# EAGLE board os22s (EAGLE 7.1.0)
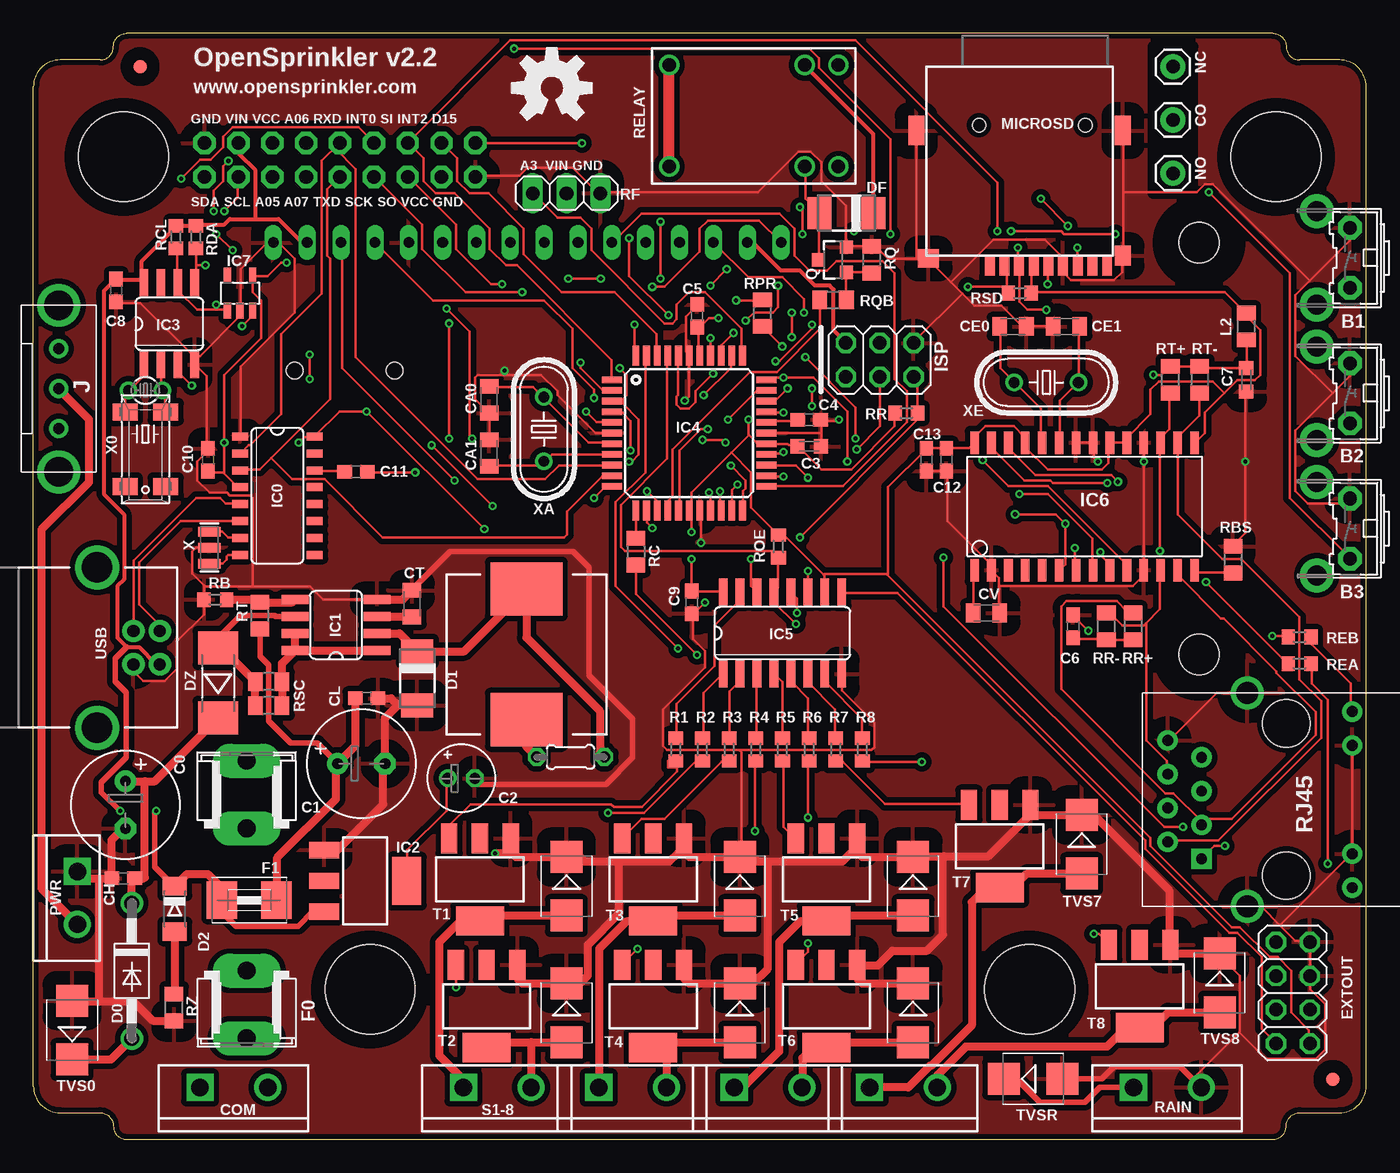
[diagram p1: board, top side]
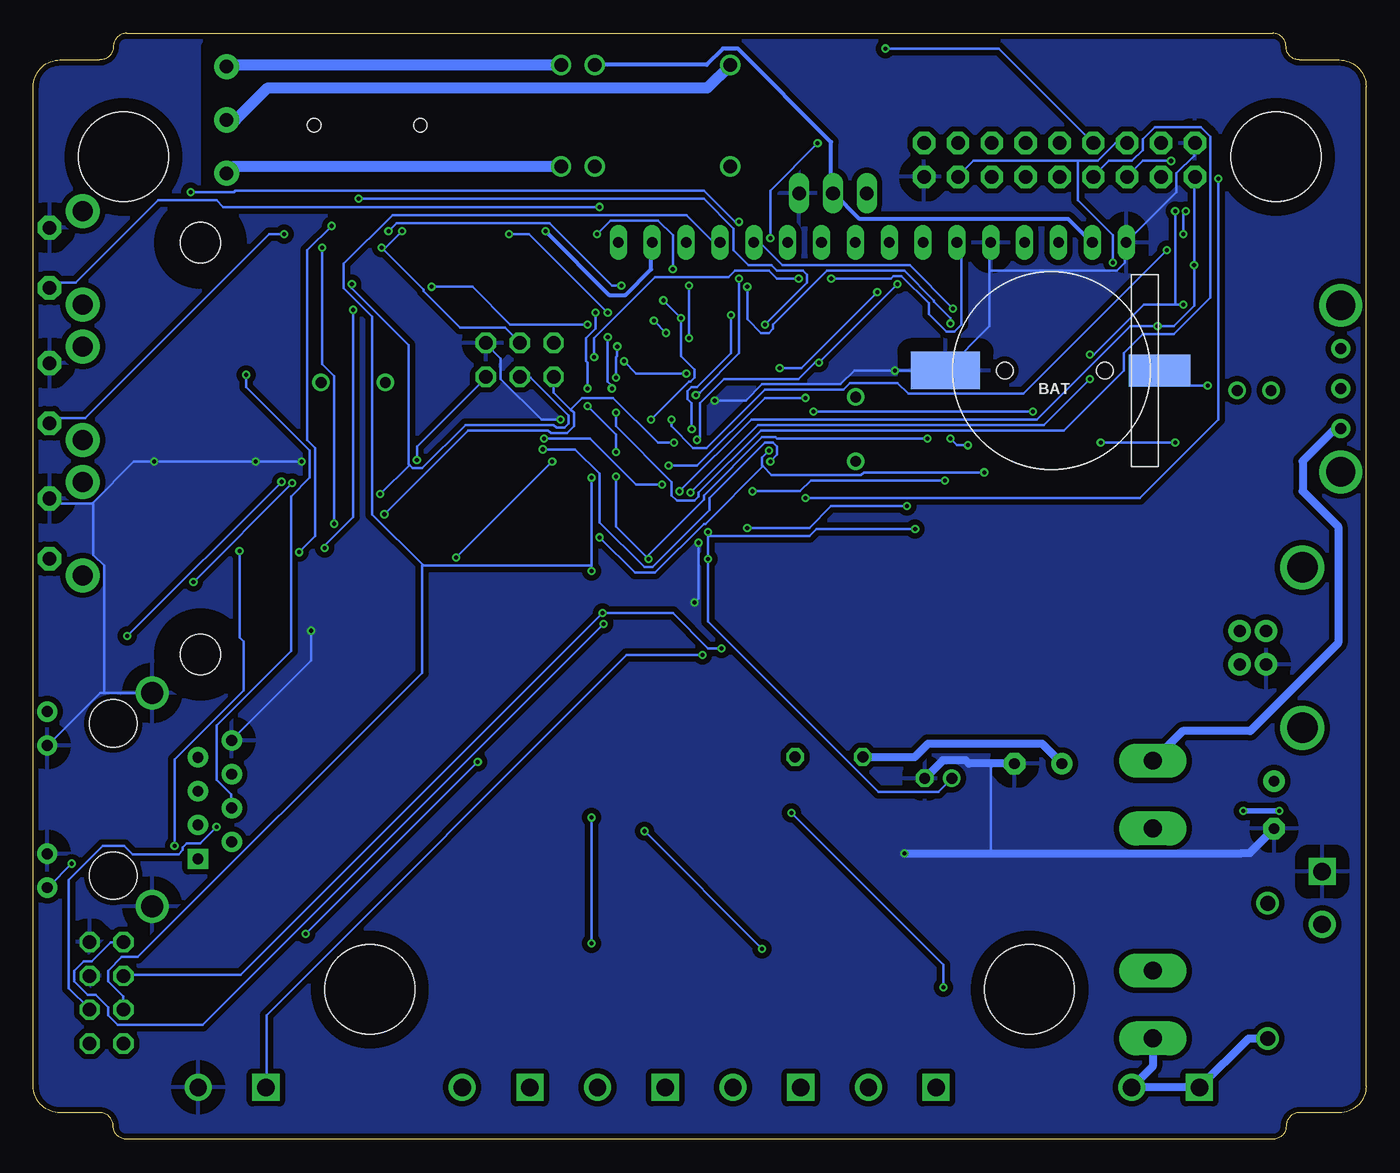
[diagram p2: board, bottom side, seen from below]

Size 100 x 83 mm. Coordinates in mm from the lower left corner, seen from the top.
Outline: 98,81 95,81 arc-90 94,82 arc90 93,83 7,83 arc90 6,82 arc-90 5,81 2,81 arc90 0,79 0,4 arc90 2,2 5,2 arc-90 6,1 arc90 7,0 93,0 arc90 94,1 arc-90 95,2 98,2 arc90 100,4 100,79 arc90 98,81
Copper layers (1*16): Top 0.035mm / dielectric 1.5mm / Bottom 0.035mm
Design rules "Fusion_eagle_rule_v1.1 *": minimum track width 6mil, minimum drill 12mil, track to track 6mil, track to pad 6mil, pad to pad 6mil, via to via 6mil, smd to smd 0mil, copper to edge 10mil, drill to drill 10mil, minimum pad ring 10mil, minimum via ring 6mil, stop-mask expansion 2mil, vias tented up to drill 100mil, thermal gap 40mil
Net classes: 0 default: width 0.203 mm, clearance 0.203 mm; 1 power: width 0.305 mm, clearance 0.203 mm; 2 relaypower: width 0.813 mm, clearance 0.305 mm
Holes 3.05 mm at 87.46,67.3 87.46,36.38
Holes 6.75 mm at 6.76,73.74 93.24,73.74 25.26,11.26 74.74,11.26
tRestrict: area 84.4,33.3 to 90.5,39.4; area 84.4,64.2 to 90.5,70.3; area 2.8,69.7 to 10.8,77.7; area 89.2,69.7 to 97.2,77.7; area 21.3,7.3 to 29.3,15.3; area 70.7,7.3 to 78.7,15.3; area 84,71 to 87,82
bRestrict: area 2.8,69.7 to 10.8,77.7; area 89.2,69.7 to 97.2,77.7; area 21.3,7.3 to 29.3,15.3; area 70.7,7.3 to 78.7,15.3; area 84.4,64.2 to 90.5,70.3; area 84.4,33.3 to 90.5,39.4; area 84,71 to 87,82
vRestrict: area 11.8,70 to 34.2,70.8; area 11.8,76.2 to 34.3,76.9; area 36.5,72.7 to 43.2,73.4

## Footprints (pad centres in the part's own frame; a part is rotated, then mirrored left to right if it is on the bottom)
B3F-31XX = drill 1.016 pad 1.778 octagon: 1 -2.261,-1.245; 2 2.261,-1.245 | drill 1.499 pad 2.54: 3 -3.505,1.245; 4 3.505,1.245
BATTCON_12MM_SMT = smd 2.8 x 5.2: P$1 0,11.96 | smd 2.4 x 4.6: P$2 0,-4.1 | hole 1.25: 0,7.5; 0,0
E3,5-8 = drill 0.813 pad 1.6: + -1.778,0 | drill 0.813 pad 1.6 octagon: - 1.778,0
E2-5 = drill 0.813 pad 1.27: + -1.016,0 | drill 0.813 pad 1.27 octagon: - 1.016,0
C0603K = smd 1.05 x 1.08: 1 -0.875,0; 2 0.875,0
C0603 = smd 1.1 x 1: 1 -0.85,0; 2 0.85,0
C0805K = smd 1.1 x 1.4: 1 -1,0; 2 1,0
SCREWTERMINAL-5MM-2-X = drill 1.3 pad 2.032 square: 1 0,0 | drill 1.3 pad 2.032: 2 5.08,0
DO41-10 = drill 1.118: A 5.08,0; C -5.08,0
DO-214AC = smd 1.8 x 2.4: A 2.025,0; C -2.025,0
MINIMELF = smd 1.4 x 1.8: A 1.7,0; C -1.7,0
MELF-MLL41 = smd 2.5 x 3: A 2.625,0; C -2.625,0
2X04 = drill 1.016 octagon: 1 -3.81,-1.27; 2 -3.81,1.27; 3 -1.27,-1.27; 4 -1.27,1.27; 5 1.27,-1.27; 6 1.27,1.27; 7 3.81,-1.27; 8 3.81,1.27
SHK20L = drill 1.321 pad 2.54 long: 1A -10.414,0; 1B -5.334,0; 2A 10.414,0; 2B 5.334,0
1812 = smd 2.286 x 2.794: 1 -2.046,0; 2 2.046,0
SO16 = smd 0.6 x 1.2: 1 -4.445,-2.8; 2 -3.175,-2.8; 3 -1.905,-2.8; 4 -0.635,-2.8; 5 0.635,-2.8; 6 1.905,-2.8; 7 3.175,-2.8; 8 4.445,-2.8; 9 4.445,2.8; 10 3.175,2.8; 11 1.905,2.8; 12 0.635,2.8; 13 -0.635,2.8; 14 -1.905,2.8; 15 -3.175,2.8; 16 -4.445,2.8
SO08 = smd 0.66 x 2.032: 1 -1.905,-3.073; 2 -0.635,-3.073; 3 0.635,-3.073; 4 1.905,-3.073; 5 1.905,3.073; 6 0.635,3.073; 7 -0.635,3.073; 8 -1.905,3.073
SOT223 = smd 1.219 x 2.235: 1 -2.311,-3.099; 2 0,-3.099; 3 2.311,-3.099 | smd 3.6 x 2.2: 4 0,3.099
TQFP44 = smd 1.5 x 0.5: 1 -5.8,4; 2 -5.8,3.2; 3 -5.8,2.4; 4 -5.8,1.6; 5 -5.8,0.8; 6 -5.8,0; 7 -5.8,-0.8; 8 -5.8,-1.6; 9 -5.8,-2.4; 10 -5.8,-3.2; 11 -5.8,-4; 23 5.8,-4; 24 5.8,-3.2; 25 5.8,-2.4; 26 5.8,-1.6; 27 5.8,-0.8; 28 5.8,0; 29 5.8,0.8; 30 5.8,1.6; 31 5.8,2.4; 32 5.8,3.2; 33 5.8,4 | smd 0.5 x 1.5: 12 -4,-5.8; 13 -3.2,-5.8; 14 -2.4,-5.8; 15 -1.6,-5.8; 16 -0.8,-5.8; 17 0,-5.8; 18 0.8,-5.8; 19 1.6,-5.8; 20 2.4,-5.8; 21 3.2,-5.8; 22 4,-5.8; 34 4,5.8; 35 3.2,5.8; 36 2.4,5.8; 37 1.6,5.8; 38 0.8,5.8; 39 0,5.8; 40 -0.8,5.8; 41 -1.6,5.8; 42 -2.4,5.8; 43 -3.2,5.8; 44 -4,5.8
SO16' = smd 0.66 x 2.032: 1 -4.445,-3.073; 2 -3.175,-3.073; 3 -1.905,-3.073; 4 -0.635,-3.073; 5 0.635,-3.073; 6 1.905,-3.073; 7 3.175,-3.073; 8 4.445,-3.073; 9 4.445,3.073; 10 3.175,3.073; 11 1.905,3.073; 12 0.635,3.073; 13 -0.635,3.073; 14 -1.905,3.073; 15 -3.175,3.073; 16 -4.445,3.073
SOIC28WLONG = smd 0.65 x 1.7: 1 -8.89,-4.78; 2 -7.62,-4.78; 3 -6.35,-4.78; 4 -5.08,-4.78; 5 -3.81,-4.78; 6 -2.54,-4.78; 7 -1.27,-4.78; 8 0,-4.78; 9 1.27,-4.78; 10 2.54,-4.78; 11 3.81,-4.78; 12 5.08,-4.78; 13 6.35,-4.78; 14 7.62,-4.78; 15 7.62,4.78; 16 6.35,4.78; 17 5.08,4.78; 18 3.81,4.78; 19 2.54,4.78; 20 1.27,4.78; 21 0,4.78; 22 -1.27,4.78; 23 -2.54,4.78; 24 -3.81,4.78; 25 -5.08,4.78; 26 -6.35,4.78; 27 -7.62,4.78; 28 -8.89,4.78
SOT23-5L = smd 0.55 x 1.2: 1 -0.95,-1.3; 2 0,-1.3; 3 0.95,-1.3; 4 0.95,1.3; 5 -0.95,1.3
2X03 = drill 1.016 octagon: 1 -2.54,-1.27; 2 -2.54,1.27; 3 0,-1.27; 4 0,1.27; 5 2.54,-1.27; 6 2.54,1.27
EG1206 = drill 0.8 pad 1.422: 1 -3,0; 2 0,0; 3 3,0 | drill 2.2: MT1 -6.25,0; MT2 6.25,0
1X01 = drill 1.016 pad 1.88: 1 0,0
2X09-CLEANBIG = drill 1.016 pad 1.676 octagon: 1 -10.16,-1.27; 2 -10.16,1.27; 3 -7.62,-1.27; 4 -7.62,1.27; 5 -5.08,-1.27; 6 -5.08,1.27; 7 -2.54,-1.27; 8 -2.54,1.27; 9 0,-1.27; 10 0,1.27; 11 2.54,-1.27; 12 2.54,1.27; 13 5.08,-1.27; 14 5.08,1.27; 15 7.62,-1.27; 16 7.62,1.27; 17 10.16,-1.27; 18 10.16,1.27
CDRH125 = smd 5.4 x 4: 1 0,4.9; 2 0,-4.9
0204/5 = drill 0.813 octagon: 1 -2.54,0; 2 2.54,0
R0805 = smd 1.1 x 1.4: 1 -1,0; 2 1,0
LCD1602A = drill 0.8 long: 1 8,33.46; 2 10.54,33.46; 3 13.08,33.46; 4 15.62,33.46; 5 18.16,33.46; 6 20.7,33.46; 7 23.24,33.46; 8 25.78,33.46; 9 28.32,33.46; 10 30.86,33.46; 11 33.4,33.46; 12 35.94,33.46; 13 38.48,33.46; 14 41.02,33.46; 15 43.56,33.46; 16 46.1,33.46
MICRO-SD-SOCKET-TAOBAO = smd 0.75 x 1.6: 1 2.25,10.5; 2 1.15,10.5; 3 0.05,10.5; 4 -1.05,10.5; 5 -2.15,10.5; 6 -3.25,10.5; 7 -4.35,10.5; 8 -5.45,10.5 | smd 0.7 x 1.6: CD -6.55,10.5 | smd 1.2 x 1.5: GND1 -7.75,9.8 | smd 1.6 x 1.4: GND3 6.85,10 | smd 1.2 x 2.2: P$1 7.75,0.4; P$2 -7.75,0.4 | hole 1: 3.05,0; -4.93,0
SCREWTERMINAL-4MM-2-X = drill 1.3 pad 2.032 square: 1 0,0 | drill 1.3 pad 2.032: 2 3.96,0
SOT23-3 = smd 1 x 1: 1 -0.95,-1; 2 0.95,-1; 3 0,1.1
R0603 = smd 1 x 1.1: 1 -0.85,0; 2 0.85,0
RELAY-HK4100F = drill 1.016: 1 12.7,7.62; 2 10.16,7.62; 5 0,7.62; 6 0,0; 9 10.16,0; 10 12.7,0
1X03 = drill 1.016 long: 1 -2.54,0; 2 0,0; 3 2.54,0
HR911105A = drill 0.813 pad 1.524: G+ 4.953,-6.604; G- 4.953,-4.064; GND -8.89,4.445; NC -6.35,3.175; P4 -8.89,-0.635; P5 -6.35,0.635; RD+ -6.35,-1.905; RD- -8.89,1.905; TD- -8.89,-3.175; Y+ 4.953,6.604; Y- 4.953,4.064 | drill 1.651 pad 2.159: SHIELD0 -2.921,8.001; SHIELD1 -2.921,-8.001 | drill 0.813 pad 1.524 square: TD+ -6.35,-4.445 | hole 3.556: 0,-5.715; 0,5.715
SMB = smd 2.4 x 2.4: A 2.2,0; C -2.2,0
FIDUCIAL_1MM = smd 1 x 1: 1 0,0
USB-B-PTH = drill 0.914 pad 1.676: D+ 0,1.25; D- 1.981,1.25; GND 0,-1.25; VBUS 1.981,-1.25 | drill 2.286: S1 -2.718,-6.02; S2 -2.718,6.02
RESONATOR-SMD = smd 0.7 x 1.7: 1 -1.2,0; 2 0,0; 3 1.2,0
MM20SS = smd 1.27 x 1.88: 1 -2.794,-1.524; 2 2.794,-1.524; 3 2.794,1.524; 4 -2.794,1.524
TC26V = drill 0.813: 1 -1.27,0; 2 1.27,0
HC49U-V = drill 0.813: 1 -2.413,0; 2 2.413,0

## Placement (x,y rotation side)
B1  [B3F-31XX]  97.54,66.15 90 top
B2  [B3F-31XX]  97.54,55.99 90 top
B3  [B3F-31XX]  97.54,45.83 90 top
BAT  CR1220  [BATTCON_12MM_SMT]  19.6,57.7 90 bottom
C0  220uF  [E3,5-8]  6.9,25.1 270 top
C1  220uF  [E3,5-8]  24.6,28.2 0 top
C2  100u  [E2-5]  32.1,27.1 0 top
C3  0.1u  [C0603K]  58.2,52 0 top
C4  0.1u  [C0603]  58.2,54 0 top
C5  0.1u  [C0603]  49.8,61.8 90 top
C6  0.1u  [C0603]  78,38.5 270 top
C7  0.1u  [C0603K]  91,57 90 top
C8  0.1u  [C0603]  6.2,63.7 270 top
C9  0.1u  [C0603]  49.4,40.3 270 top
C10  0.1u  [C0603]  13.1,51 270 top
C11  0.1u  [C0603]  24.2,50.1 0 top
C12  0.1u  [C0603]  68.5,51 270 top
C13  0.1u  [C0603]  67,51 270 top
CA0  18p  [C0805K]  34.2,55.5 270 top
CA1  18p  [C0805K]  34.2,51.5 90 top
CE0  18p  [C0805K]  73.5,61 0 top
CE1  18p  [C0805K]  77.5,61 180 top
CH  0.1u  [C0603]  6.75,19.6 180 top
CL  0.1u  [C0603]  25,33.1 0 top
COM  [SCREWTERMINAL-5MM-2-X]  12.5,3.9 0 top
CT  180p  [C0805K]  28.4,40.2 90 top
CV  10u  [C0805K]  71.5,39.5 0 top
D0  R3000  [DO41-10]  7.38,12.65 270 top
D1  SS16  [DO-214AC]  28.8,34.6 270 top
D2  5.6V  [MINIMELF]  10.6,17.3 270 top
DF  S1B  [DO-214AC]  61,69.5 180 top
DZ  5.1V  [MELF-MLL41]  13.85,34.25 90 top
EXTOUT  [2X04]  94.5,11 90 top
F0  2A  [SHK20L]  16,18 270 top
F1  500mA  [1812]  16.2,17.95 180 top
IC0  CH340G  [SO16]  18.3,48.3 270 top
IC1  34063  [SO08]  22.7,38.6 90 top
IC2  1117-33  [SOT223]  24.9,19.4 270 top
IC3  DS1307  [SO08]  10.2,61.2 0 top
IC4  ATMEGA644  [TQFP44]  49.2,53 0 top
IC5  74HC595N  [SO16']  56.2,38 0 top
IC6  ENC28J60  [SOIC28WLONG]  79.5,47.5 0 top
IC7  24AA02E  [SOT23-5L]  15.5,63.5 0 top
ISP  [2X03]  63.5,58.5 0 top
J  EG1206  [EG1206]  1.9,56.34 270 top
JC  [1X01]  85.5,80.5 0 top
JO  [1X01]  85.5,72.5 0 top
JP2  [2X09-CLEANBIG]  23,73.5 0 top
JR  [1X01]  85.5,76.5 0 top
L1  [CDRH125]  37,36.4 0 top
L1'  220uH  [0204/5]  40.3,28.7 180 top
L2  Bead  [R0805]  91,61 90 top
LCD  LCD1602  [LCD1602A]  10,33.84 0 top
MICROSD  [MICRO-SD-SOCKET-TAOBAO]  74,76.1 180 top
PWR  24VAC  [SCREWTERMINAL-4MM-2-X]  3.3,20.1 270 top
Q  2N3904  [SOT23-3]  60,66 90 top
R1  300  [R0603]  48.2,29.25 90 top
R2  300  [R0603]  50.2,29.25 90 top
R3  300  [R0603]  52.2,29.25 90 top
R4  300  [R0603]  54.2,29.25 90 top
R5  300  [R0603]  56.2,29.25 90 top
R6  300  [R0603]  58.2,29.25 90 top
R7  300  [R0603]  60.2,29.25 90 top
R8  300  [R0603]  62.2,29.25 90 top
RAIN  [SCREWTERMINAL-5MM-2-X]  82.55,3.9 0 top
RB  10K  [R0603]  13.65,40.5 180 top
RBS  2.32K  [R0805]  90,43.5 270 top
RC  4.7K  [R0805]  45.2,44.1 270 top
RCL  10K  [R0603]  10.7,67.7 90 top
RDA  10K  [R0603]  12.2,67.7 90 top
REA  330  [R0603]  95,35.7 0 top
REB  330  [R0603]  95,37.7 0 top
RELAY  RELAY-2  [RELAY-HK4100F]  47.7,73 0 top
RF  [1X03]  40,71 0 top
RJ45  HR911105A  [HR911105A]  94,25.5 0 top
ROE  10K  [R0603]  55.9,44.5 90 top
RPR  1.5k  [R0805]  54.7,62 90 top
RQ  10K  [R0805]  62.9,66 90 top
RQB  1K  [R0805]  60,63 0 top
RR  10K  [R0603]  65.5,54.5 180 top
RR+  49.9  [R0805]  82.5,38.5 270 top
RR-  49.9  [R0805]  80.5,38.5 90 top
RSC  1  [R0805]  17.65,34.35 180 top
RSC1  1  [R0805]  17.65,32.55 180 top
RSD  10K  [R0603]  74,63.5 0 top
RT  30K  [R0805]  17,39.3 90 top
RT+  49.9  [R0805]  85.3,57 90 top
RT-  49.9  [R0805]  87.5,57 270 top
RZ  1  [R0805]  10.55,9.9 90 top
S12  [SCREWTERMINAL-5MM-2-X]  32.26,3.9 0 top
S34  [SCREWTERMINAL-5MM-2-X]  42.42,3.9 0 top
S56  [SCREWTERMINAL-5MM-2-X]  52.58,3.9 0 top
S78  [SCREWTERMINAL-5MM-2-X]  62.74,3.9 0 top
T1  BT1308W  [SOT223]  33.5,19.5 180 top
T2  BT1308W  [SOT223]  34,10 180 top
T3  BT1308W  [SOT223]  46.5,19.5 180 top
T4  BT1308W  [SOT223]  46.5,10 180 top
T5  BT1308W  [SOT223]  59.5,19.5 180 top
T6  BT1308W  [SOT223]  59.5,10 180 top
T7  BT1308W  [SOT223]  72.5,22 180 top
T8  BT1308W  [SOT223]  83,11.5 180 top
TVS0  48CA  [SMB]  2.9,8.2 90 top
TVS1  SMBJ48CA  [SMB]  40,19 270 top
TVS2  SMBJ48CA  [SMB]  40,9.5 270 top
TVS3  SMBJ48CA  [SMB]  53,19 270 top
TVS4  SMBJ48CA  [SMB]  53,9.5 270 top
TVS5  SMBJ48CA  [SMB]  66,19 270 top
TVS6  SMBJ48CA  [SMB]  66,9.5 270 top
TVS7  SMBJ48CA  [SMB]  78.65,22.15 270 top
TVS8  SMBJ48CA  [SMB]  89,11.75 270 top
TVSR  48CA  [SMB]  75,4.55 0 top
U$1  FIDUCIAL  [FIDUCIAL_1MM]  8,80.5 0 top
U$3  FIDUCIAL  [FIDUCIAL_1MM]  97.5,4.5 0 top
USB  USBPTH  [USB-B-PTH]  7.5,36.9 0 top
X  12MHz  [RESONATOR-SMD]  13.2,44.4 270 top
X0  32.768kHz  [MM20SS]  8.4,51.8 270 top
X1  32.768kHz  [TC26V]  8.4,56.2 180 top
XA  12MHz  [HC49U-V]  38.3,53.3 90 top
XE  25MHz  [HC49U-V]  76,56.8 180 top

## Tracks (layer width: path | path; a pad name or v marks a point on that pad's centre or on a via)
A0  (via drill 0.3)
  Top 0.203: v50.8,60.12 IC4.37 | v52.02,65.3 v50.8,64.08 | v57.71,67.94 57.71,69.77 v57.51,69.97
  Bottom 0.203: v50.8,64.08 v50.8,60.12 | v52.02,65.3 52.02,67.84 53.14,68.95 56.69,68.95 v57.71,67.94 | v57.51,69.97 85.75,69.97 86.26,70.48 90.63,70.48 96.83,64.28 98.45,64.28 98.75,63.98 B1.1
A1  (via drill 0.3)
  Top 0.203: v52.53,60.52 51.61,59.61 51.61,58.9 IC4.36 | v53.44,61.44 54.05,62.05 55.47,62.05 55.88,62.45 v55.88,64.08 | v73.36,68.14 77.11,68.14 77.32,67.94 v81.18,67.94
  Bottom 0.203: v53.44,61.44 v52.53,60.52 | v55.88,64.08 56.59,64.08 61.27,68.75 72.75,68.75 v73.36,68.14 | v81.18,67.94 82.3,67.94 96.11,54.12 98.45,54.12 98.75,53.82 B2.1
A2  (via drill 0.3)
  Top 0.203: v50.29,55.85 52.32,57.88 52.32,58.79 IC4.35 | v47.04,68.85 v47.04,64.59 | v88.19,71.09 94.28,64.99 94.28,48.13 98.75,43.66 B3.1
  Bottom 0.203: v50.29,55.85 50.09,56.05 49.99,56.05 47.04,59 v47.04,64.59 | v47.04,68.85 47.35,68.85 49.68,71.19 84.84,71.19 84.94,71.09 v88.19,71.09
A3
  Top 0.203: IC4.34 53.14,58.9 53.14,60.83 50.39,63.57 49.17,63.57 48.26,62.66 48.26,61.54 47.95,61.23 47.35,61.23 41.86,66.72 41.86,68.34 41.05,69.16 39.32,69.16 37.49,70.99 RF.1
A4  (via drill 0.3)
  Top 0.203: v56.19,59.51 54.76,60.93 RPR.1 | IC4.33 55.17,57.17 v56.29,57.17 58.52,57.17 61.06,54.63 v61.06,50.87 | v68.28,43.66 68.28,40 84.84,23.44 v86.26,23.44
  Bottom 0.203: v56.19,59.51 56.19,58.79 56.29,58.69 v56.29,57.17 | v68.28,43.66 v61.06,50.87 | v86.26,23.44 87.48,22.22 88.49,22.22 88.8,21.91 88.8,21.71 89.1,21.41 92.56,21.41 93.17,22.02 94.79,22.02 97.33,19.48 97.33,11.35 95.81,9.82 EXTOUT.3
A5  (via drill 0.3)
  Top 0.203: v52.12,54.02 54.25,56.15 54.97,56.15 IC4.32 | v13.72,67.94 v14.94,66.72 | v13.51,69.67 13.51,71.19 14.22,71.9 14.22,73.02 v14.63,73.42
  Bottom 0.203: v52.12,54.02 52.12,53.51 50.49,51.89 49.48,51.89 45.11,56.25 39.22,56.25 38.71,56.76 35.15,56.76 34.34,55.95 25.7,55.95 v14.94,66.72 | v13.72,67.94 13.72,69.46 v13.51,69.67 | v14.63,73.42 16.76,73.42 17.88,72.31 JP2.5
A6  (via drill 0.3)
  Top 0.203: v56.59,56.36 55.68,55.44 55.07,55.44 IC4.31 | v56.9,62.05 v56.9,60.22 | v64.31,67.94 64.31,75.05 58.93,80.44 58.93,81.15 58.22,81.86 v36.07,81.86
  Bottom 0.203: v56.59,56.36 56.59,56.56 56.9,56.86 v56.9,60.22 | v56.9,62.05 62.79,67.94 v64.31,67.94 | v36.07,81.86 27.53,81.86 20.52,74.85 JP2.8
A7  (via drill 0.3)
  Top 0.203: v56.29,54.53 55.07,54.53 IC4.30
  Bottom 0.203: v56.29,54.53 56.29,53.51 52.12,49.35 52.12,48.33 51.71,47.92 50.39,47.92 50.09,48.23 50.09,48.53 45.41,53.21 22.66,53.21 18.19,57.68 18.19,59 16.76,60.42 14.43,60.42 11.68,63.16 11.68,75.25 12.39,75.97 15.85,75.97 16.76,75.05 16.76,74.24 17.58,73.42 19.3,73.42 20.42,72.31 JP2.7
ACIN
  Top 0.61: TVS0.C 5.82,6 D0.A
  Bottom 0.61: F0.2A 16,5.48 COM.2 COM.1 8.83,7.57 D0.A
AREF
  Top 0.203: C4.1 57.3,53.92 55.17,53.92 55.07,53.82 IC4.29
CO
  Top 0.813: RELAY.6 RELAY.5
  Bottom 0.813: JR.1 84.8,76.5 82.4,78.9 49.42,78.9 RELAY.5
D0  (via drill 0.3)
  Top 0.203: 73.05,63.98 73.05,65.4 72.95,65.5 MICROSD.2 | 73.05,63.98 73.05,63.57 RSD.1 73.05,63.98 | v51,57.47 49.68,56.15 49.68,55.34 49.17,54.83 48.56,54.83 48.26,55.14 48.26,55.75 48.36,55.85 48.36,58.79 IC4.40 | v55.68,58.39 55.98,58.39 58.42,60.83 v58.42,61.13 | 73.05,63.98 v70.1,63.98
  Bottom 0.203: v51,57.47 54.76,57.47 v55.68,58.39 | v58.42,61.13 64.21,61.13 67.06,63.98 v70.1,63.98
D1  (via drill 0.3)
  Top 0.203: IC4.41 47.55,58.79 47.55,51.07 44.09,47.62 44.09,44.47 44.4,44.16 55.47,44.16 55.88,43.76 ROE.1 55.88,43.55 55.88,41.42 55.58,41.12 IC5.13 55.58,41.01 55.58,40.3 v57.2,38.68
  Bottom 0.203: v57.2,38.68 87.27,8.6 93.67,8.6 94.39,9.32 94.39,9.93 95.3,10.84 95.91,10.84 96.93,11.86 96.93,12.67 96.22,13.38 95.61,13.38 94.18,14.8 93.27,14.8 EXTOUT.8
D3  (via drill 0.3)
  Top 0.203: v48.36,36.85 43.69,41.52 43.69,47.82 45.92,50.06 45.92,58.79 IC4.43 | v57.3,39.49 57.3,40.61 56.9,41.01 IC5.12
  Bottom 0.203: v48.36,36.85 49.38,36.85 52.02,39.49 v57.3,39.49 84.43,12.36 93.17,12.36 EXTOUT.6
D4  (via drill 0.3)
  Top 0.203: v45.11,61.13 45.11,58.9 IC4.44 | v77.62,68.55 v75.59,70.58 | v80.06,44.06 80.06,43.86 80.67,43.25 80.67,42.74 IC6.9
  Bottom 0.203: v45.11,61.13 41.96,64.28 41.96,64.89 42.27,65.19 44.2,65.19 44.6,65.6 46.33,65.6 47.45,66.72 47.45,68.34 49.68,70.58 v75.59,70.58 | v77.62,68.55 79.45,66.72 79.45,52.49 78.84,51.89 78.84,45.28 v80.06,44.06
D12  (via drill 0.3)
  Top 0.203: v46.43,45.89 46.02,46.3 46.02,47.11 IC4.13 | v29.87,52.09 v34.44,47.52 | v31.19,61.23 v31.19,52.6 | v46.43,63.98 47.35,63.98 49.99,66.62 49.99,68.34 50.6,68.95 54.46,68.95 56.08,67.33 LCD.16
  Bottom 0.203: v46.43,45.89 41.76,45.89 40.13,47.52 v34.44,47.52 | v29.87,52.09 30.68,52.09 v31.19,52.6 | v31.19,61.23 31.19,61.64 32.41,62.86 32.41,62.96 34.65,65.19 40.44,65.19 44.5,61.13 44.5,60.83 44.81,60.52 45.41,60.52 46.43,61.54 v46.43,63.98
D13  (via drill 0.3)
  Top 0.203: v46.02,48.63 46.74,47.92 46.74,47.21 IC4.14 | v31.6,49.45 23.16,57.88 23.16,67.23 LCD.3
  Bottom 0.203: v46.02,48.63 42.47,48.63 41.66,49.45 v31.6,49.45
D14
  Top 0.203: RQB.1 59.03,62.96 59.03,60.83 55.78,57.58 53.75,57.58 47.95,51.78 47.95,48.23 47.65,47.92 47.65,47.21 IC4.15
D15  (via drill 0.3)
  Top 0.203: v50.6,53.31 50.09,53.31 48.46,51.68 48.46,47.21 IC4.16 | v47.65,61.84 44.7,64.79 v44.7,67.63 | v41.15,74.75 33.22,74.75 JP2.18
  Bottom 0.203: v50.6,53.31 50.6,55.24 50.9,55.54 50.9,56.15 50.6,56.46 50.19,56.46 47.65,59 v47.65,61.84 | v44.7,67.63 44.7,71.19 v41.15,74.75
D18  (via drill 0.3)
  Top 0.203: v52.83,49.14 52.43,48.74 52.43,47.21 IC4.21 | v61.67,52.6 61.67,54.93 v57.91,58.69 | v40.13,64.59 v42.57,64.59
  Bottom 0.203: v52.83,49.14 54.76,49.14 58.22,52.6 v61.67,52.6 | v57.91,58.69 57.91,60.12 53.34,64.69 47.85,64.69 47.35,65.19 44.81,65.19 44.2,64.59 v42.57,64.59 | v40.13,64.59 35.66,64.59 35.46,64.79 34.85,64.79 32.82,62.76 32.82,61.94 31.5,60.62 30.89,60.62 30.38,61.13 30.38,66.92 30.68,67.23 LCD.6
D19  (via drill 0.3)
  Top 0.203: v52.32,50.56 53.44,49.45 53.44,48.84 53.24,48.63 53.24,47.21 IC4.22 | v42.06,55.65 42.06,56.25 40.44,57.88 40.44,60.83 38.3,62.96 29.97,62.96 25.7,67.23 LCD.4
  Bottom 0.203: v52.32,50.56 50.19,50.56 45.11,55.65 v42.06,55.65
D20
  Top 0.203: IC4.23 55.07,49.04 60.76,49.04 65.53,53.82 65.53,56.15 64.62,57.07 64.62,64.99 63.7,65.91 60.25,65.91 59.54,65.19 58.22,65.19 57.1,66.31 57.1,68.34 55.98,69.46 45.62,69.46 43.48,67.33 LCD.11
D21  (via drill 0.3)
  Top 0.203: v56.29,49.75 55.07,49.75 IC4.24 | v53.85,43.55 53.85,41.52 54.25,41.12 IC5.14 | v30.99,62.35 32.72,60.62 32.72,52.8 v32.92,52.6
  Bottom 0.203: v56.29,49.75 56.29,45.99 v53.85,43.55 53.95,43.76 49.68,48.02 49.68,48.33 45.31,52.7 44.3,52.7 44.2,52.6 v32.92,52.6 | v30.99,62.35 34.24,65.6 43.79,65.6 45.41,67.23 45.92,67.23 LCD.12
D22  (via drill 0.3)
  Top 0.203: v58.12,49.65 57.2,50.56 55.07,50.56 IC4.25 | v58.12,42.64 58.12,41.12 IC5.11
  Bottom 0.203: v58.12,42.64 58.12,43.05 | 58.12,43.05 v58.12,49.65 | 70.76,43.1 70.71,43.05 58.12,43.05 | 70.76,43.1 74.57,46.91 74.57,61.74 76.71,63.87 76.71,65.7 73.05,69.36 51,69.36 48.97,67.33 48.56,67.33 LCD.13 | EXTOUT.4 93.27,9.82 93.27,10.74 94.39,11.86 94.39,12.67 93.37,13.68 92.15,13.68 70.81,35.02 70.81,43.05 70.76,43.1
D23  (via drill 0.3)
  Top 0.203: v56.29,51.58 56.19,51.48 55.07,51.48 IC4.26 | v58.42,56.36 v58.42,55.03 | v57.81,62.05 57.81,63.06 56.19,64.69 53.65,64.69 51.1,67.23 LCD.14
  Bottom 0.203: v56.29,51.58 56.29,52.9 v58.42,55.03 | v58.42,56.36 58.42,58.29 58.52,58.39 58.52,60.12 57.81,60.83 v57.81,62.05
D+
  Top 0.203: IC0.5 15.44,47.72 14.43,47.72 14.02,48.13 12.19,48.13 7.52,43.45 7.52,38.17 USB.D+
D-
  Top 0.203: IC0.6 11.05,46.4 7.95,43.3 7.95,40.15 9.45,38.65 9.45,38.15 USB.D-
GND  (via drill 0.3)
  Top 0.203: JP2.17 33.22,72.31 36.47,72.31 37.08,72.92 40.44,72.92 42.37,70.99 RF.3 42.57,71.09 54.36,71.09 57.4,74.14 58.32,74.14 59.13,73.32 59.13,71.9 60.96,70.07 60.96,67.02 Q.2 61.06,67.02 62.89,67.02 RQ.2 62.99,66.92 63.3,66.92 64.11,66.11 66.24,66.11 | 81.79,71.09 81.79,66.31 MICROSD.GND1 81.69,66.21 81.69,65.09 81.08,64.48 77.83,64.48 77.32,64.99 77.32,65.5 MICROSD.6 77.22,65.6 77.22,66.21 75.89,67.53 72.03,67.53 68.83,64.33 | 81.79,71.09 81.79,75.66 MICROSD.P$2 | 59.13,53 59.13,53.92 C4.2 59.23,53.92 60.35,53.92 v60.45,54.02 | 59.13,53 59.13,52.09 C3.2 | 59.13,53 55.07,53 IC4.28 | CE1.2 76.4,61.03 74.57,61.03 CE0.2 74.47,61.03 74.17,61.03 72.64,62.55 70.61,62.55 69.7,63.47 | 66.24,66.11 67.06,66.11 MICROSD.GND3 67.16,66.01 68.83,64.33 | 68.83,64.33 69.7,63.47 | 66.24,66.11 66.24,75.66 MICROSD.P$1 | 69.7,63.47 66.04,59.81 ISP.6 | IC3.4 12.19,58.08 13.01,57.27 13.01,51.89 C10.1 13.01,51.78 13.01,51.58 12.29,50.87 12.29,49.45 13.21,48.53 14.53,48.53 14.73,48.33 16.26,48.33 16.46,48.13 16.46,41.5 | C8.2 6.3,62.76 8.03,62.76 12.09,58.69 12.09,58.19 IC3.4 | IC3.4 12.09,58.79 12.5,58.79 15.44,61.74 15.44,62.15 IC7.2 15.54,62.25 15.54,65.3 17.48,67.23 17.98,67.23 LCD.1 18.09,67.23 18.49,67.23 19.61,66.11 19.61,62.05 15.54,57.98 15.54,52.9 IC0.1 15.54,52.8 | CA1.2 34.24,52.6 34.24,54.43 CA0.2 34.14,54.53 33.12,55.54 33.12,57.17 33.33,57.37 35.36,57.37 | IC6.18 83.31,52.19 v83.31,50.87 83.31,42.74 IC6.11 83.21,42.64 83.21,42.23 82.5,41.52 72.44,41.52 | C13.2 67.06,50.16 68.48,50.16 C12.2 68.58,50.06 68.58,46.4 71.83,43.15 71.83,42.74 IC6.2 71.93,42.64 72.44,42.13 72.44,41.52
  Top 0.203: 72.44,41.52 72.44,39.59 CV.2 | C7.1 90.93,56.05 v90.93,50.87 90.93,45.48 90.02,44.57 RBS.1 | IC6.22 78.23,52.29 79.45,52.29 IC6.21 79.55,52.19 79.55,51.17 v79.86,50.87 | 97.48,56 94.69,53.21 94.69,48.63 95.61,47.72 98.45,47.72 98.75,48.02 B3.2 | 97.48,56 98.75,57.27 98.75,58.19 B2.2 | 95.76,64.43 94.69,63.37 94.69,58.79 97.48,56 | 95.76,64.43 98.75,67.43 98.75,68.34 B1.2 | v79.15,38.17 78.03,39.29 C6.1 | RJ45.SHIELD0 91.03,33.5 88.8,33.5 85.34,30.04 85.14,30.04 RJ45.GND | RJ45.Y- 98.96,29.53 98.96,21.51 RJ45.G- 98.86,21.41 93.52,16.07 | 93.52,16.07 92.15,17.44 91.14,17.44 RJ45.SHIELD1 | 93.52,16.07 94.69,14.9 95.71,14.9 EXTOUT.7 95.81,14.8 95.81,12.36 EXTOUT.5 95.81,12.26 95.81,11.25 96.93,10.13 96.93,6.78 96.22,6.06 92.46,6.06 90.47,8.04 | 49.48,39.39 49.48,37.56 50.39,36.65 50.39,35.43 47.24,32.28 47.24,29.53 47.55,29.23 52.93,29.23 52.98,29.18 | 52.98,29.18 53.14,29.03 53.14,21.41 TVS3.C | v50.09,44.77 50.09,47.11 IC4.18 | 49.48,39.39 v50.39,40.3 | 49.48,39.39 C9.2 | IC5.8 60.66,34.92 60.66,33.7 63.09,31.26 63.09,29.43 62.89,29.23 53.03,29.23 52.98,29.18 | 90.47,8.04 90.53,8.1 90.53,12.26 89.1,13.68 TVS8.C | 90.47,8.04 87.07,4.64 RAIN.2 | 81.79,71.09 87.27,71.09 87.88,71.7 88.49,71.7 95.76,64.43 | 35.36,57.37 38.1,57.37 39.32,56.15 39.32,55.85 42.16,53 43.38,53 IC4.6 | v48.87,55.44 49.17,55.75 49.17,58.79 IC4.39 49.17,58.9 48.97,59.1 48.97,61.74 49.78,62.55 C5.2 | v35.36,57.68 35.36,57.37 | USB.GND 7.5,35.15 8.25,34.4 9.85,34.4 10.75,35.3 10.75,37.35 12.8,39.4 RB.2 12.8,41.5 | 12.8,41.5 12.8,41.55 11.9,42.45 11.9,44.1 12.2,44.4 X.2 | 12.8,41.5 16.46,41.5
  Top 0.203: 16.46,41.5 20.75,41.5 21.75,40.5 25.5,40.5 IC1.4
  Top 0.406: TVSR.A 80.15,4.55 81.05,5.45 86.05,5.45 87.6,3.9 RAIN.2 | IC1.4 27.66,40.51 31.25,44.1 40.5,44.1 41.7,42.9 41.7,34.8 44.95,31.55 44.95,28.65 42.95,26.65 33.57,26.65 C2.-
  Top 0.61: 35.8,21.6 36.2,21.2 TVS1.C 41,21.2 41.35,20.85 43.95,20.85 | 35.8,21.6 35.8,22.55 T1.1 | TVS8.C 85.3,13.95 85.3,14.55 T8.1 85.3,14.9 85.3,15.55 85.25,15.6 85.25,18.65 79.55,24.35 TVS7.C 74.85,24.35 74.8,24.4 74.8,25.05 T7.1 74.6,24.2 71.65,21.25 68.3,21.25 | T2.1 36.3,13.05 36.3,12.1 36.7,11.7 TVS2.C 41,11.7 41.6,12.3 41.6,14.6 43.95,16.95 43.95,20.85 | T4.1 48.8,13.05 48.8,12.1 49.2,11.7 TVS4.C 54,11.7 55.1,12.8 55.1,20.85 | TVS6.C 62.2,11.7 61.8,12.1 61.8,13.05 | 61.8,13.05 T6.1 | 4.95,19.6 3.8,19.6 PWR.1 | 4.95,19.6 CH.2 5.85,19.65 5.85,22.45 6.72,23.32 C0.- | 43.95,20.85 47.7,20.85 48.35,21.5 48.5,21.5 T3.1 48.8,22.55 48.8,21.6 49.2,21.2 TVS3.C 54,21.2 54.35,20.85 55.1,20.85 | 55.1,20.85 60.7,20.85 61.35,21.5 61.5,21.5 T5.1 61.8,22.55 61.8,21.6 62.2,21.2 TVS5.C 67,21.2 67.05,21.25 68.3,21.25 | 61.8,13.05 63.35,13.05 64.45,14.15 67.05,14.15 68.25,15.35 68.25,21.2 68.3,21.25 | IC1.4 27.7,40.51 CT.2 | 27.35,32.6 28.8,32.6 D1.A | 27.35,32.6 26.85,33.1 CL.2 | 27.35,32.6 26.38,31.63 C1.- 26.25,27.9 26.25,25.15 22.8,21.7 21.85,21.7 IC2.1 | v34.65,21.45 35.55,21.45 35.8,21.6 | RZ.1 8.95,8.9 7.5,10.35 4.95,10.35 | 4.95,10.35 3.95,10.35 3.9,10.4 TVS0.A | 4.95,10.35 4.95,19.6
  Bottom 0.203: v60.45,54.02 61.87,54.02 64.92,57.07 64.92,58.59 66.04,59.71 ISP.6 | JP2.2 12.9,74.75 12.9,73.83 14.22,72.51 14.22,71.09 17.98,67.33 LCD.1 18.09,67.23 18.09,65.81 18.69,65.19 28.25,65.19 | 28.25,65.19 28.25,61.03 31.5,57.78 BAT.P$1 31.6,57.68 v35.36,57.68 38.41,57.68 39.42,56.66 45.31,56.66 46.53,55.44 v48.87,55.44 | 28.25,65.19 28.25,67.23 LCD.5 | v79.86,50.87 v83.31,50.87 v90.93,50.87 92.46,50.87 95.56,47.77 | 95.56,47.77 95.61,47.72 98.45,47.72 98.75,48.02 B3.2 | v79.15,38.17 79.15,35.93 85.04,30.04 RJ45.GND | 94.69,33.5 95,33.5 98.86,29.64 RJ45.Y- | 94.69,33.5 91.14,33.5 RJ45.SHIELD0 | v50.09,44.77 50.09,40.61 v50.39,40.3 | 28.14,21.45 28.14,28.2 | 94.69,33.5 94.69,43.05 95.5,43.86 95.5,47.72 95.56,47.77
  Bottom 0.61: C1.- 28.14,28.2 29.8,28.2 30.05,28.45 31.77,28.45 C2.- | v34.65,21.45 28.14,21.45 9.4,21.45 9.35,21.5 8.72,21.5 C0.-
  pour Top (isolate 0.406): 0,84 100,84 100,0 0,0
  pour Bottom (isolate 0.406): 0,84 100,84 100,0 0,0
INT0  (via drill 0.3)
  Top 0.203: v42.06,48.13 42.88,48.94 43.38,48.94 IC4.11 | v11.07,72.1 12.5,73.53 13.31,73.53 14.22,74.44 14.22,75.25 14.94,75.97 24.38,75.97 25.5,74.85 JP2.12
  Bottom 0.203: v42.06,48.13 16.97,48.13 11.07,54.02 v11.07,72.1
INT1
  Top 0.203: RC.1 45.21,45.18 45.21,47.11 IC4.12
INT2
  Top 0.203: IC4.42 46.74,58.9 46.74,60.42 43.59,63.57 39.62,63.57 36.78,66.41 36.78,68.34 34.14,70.99 32.72,70.99 31.8,71.9 31.8,73.63 30.68,74.75 JP2.16
LEDA  (via drill 0.3)
  Top 0.203: v97.13,20.69 97.13,32.99 95.91,34.21 95.91,35.63 REA.2
  Bottom 0.203: v97.13,20.69 98.86,18.97 RJ45.G+
LEDB
  Top 0.203: REB.2 95.91,37.66 95.91,37.15 98.86,34.21 98.86,32.17 RJ45.Y+
MISO  (via drill 0.3)
  Top 0.203: v41.05,58.29 41.05,57.88 42.67,56.25 43.38,56.25 IC4.2 | v35.15,64.18 34.34,64.18 31.7,66.82 31.7,68.65 28.14,72.21 JP2.13 | v78.33,66.92 78.33,65.6 MICROSD.7 | IC6.6 77.01,42.74 77.42,43.15 v77.42,46.2 76.71,46.91 v73.66,46.91 | v50.19,52.49 51.71,52.49 v51.92,52.29
  Bottom 0.203: v35.15,64.18 v41.05,58.29 41.35,58.29 42.57,57.07 48.16,57.07 49.99,55.24 49.99,52.7 v50.19,52.49 | v78.33,66.92 78.33,58.19 77.42,57.27 v77.42,46.2 | ISP.1 60.96,56.05 59.69,54.78 | 59.69,54.78 59.44,54.53 59.44,53.51 59.94,53 61.16,53 61.37,53.21 67.36,53.21 v73.66,46.91 | v51.92,52.29 53.14,52.29 56.49,55.65 58.83,55.65 59.69,54.78
MOSI  (via drill 0.3)
  Top 0.203: IC4.1 43.38,57.07 43.38,58.49 36.27,65.6 35.46,65.6 34.24,66.82 34.24,68.34 31.6,70.99 30.18,70.99 29.26,71.9 29.26,73.63 28.14,74.75 JP2.14 28.14,74.85 35.76,82.47 61.67,82.47 72.34,71.8 v72.34,68.14 | v73.86,66.92 73.86,65.6 MICROSD.3 73.97,65.5 73.97,62.86 74.57,62.25 v76,62.25 | v78.13,44.37 78.13,42.74 IC6.7
  Bottom 0.203: ISP.4 63.5,59.81 64.62,60.93 67.97,60.93 70.71,63.67 70.71,63.77 v73.86,66.92 73.66,66.82 v72.34,68.14 | v78.13,44.37 78.13,44.57 76,46.7 v76,62.25
N$1
  Top 0.61: PWR.2 0.6,18.85 0.6,45.75 4.15,49.3 4.15,54.05 1.9,56.3 J.2
N$2
  Top 0.203: 60.96,63.06 RQB.2 60.96,63.16 60.96,64.99 Q.1 61.06,65.09 62.89,65.09 RQ.1
N$3  (via drill 0.3)
  Top 0.203: v49.78,36.34 45.21,40.91 45.21,43.05 RC.2
  Top 0.406: RAIN.1 80,3.9 78.9,2.8 75.5,2.8 73.75,4.55 TVSR.C
  Bottom 0.203: v49.78,36.34 55.47,36.34 82.5,9.32 82.5,3.93 RAIN.1
N$4
  Top 0.203: R6.2 58.12,30.14 58.12,33.09 56.9,34.31 56.9,34.92 IC5.5
N$5
  Top 0.203: R7.2 60.15,30.14 60.15,32.28 58.12,34.31 58.12,34.92 IC5.6
N$6
  Top 0.203: X.1 14.15,45.6 14.6,45.15 15.5,45.15 IC0.7
N$7
  Top 0.203: R8.2 62.18,30.14 62.18,31.57 59.44,34.31 59.44,34.92 IC5.7
N$8
  Top 0.203: IC3.2 9.6,58.1 9.6,56.2 X1.1 9.7,56.1 9.9,55.9 9.9,54.6 X0.4
N$9
  Bottom 0.61: J.3 2.31,53.34 4.75,50.9 4.75,48.65 2.1,46 2.1,37.25 8.7,30.65 13.76,30.65 F0.1A
N$10
  Top 0.203: R5.2 56.19,30.14 56.19,34.31 55.58,34.92 IC5.4
N$11
  Top 0.203: R4.2 54.25,30.14 54.25,34.92 IC5.3
N$12
  Top 0.203: R3.2 52.22,30.14 52.22,33.6 52.93,34.31 52.93,34.92 IC5.2
N$13
  Top 0.203: R2.2 50.29,30.14 50.29,33.5 51.71,34.92 IC5.1
N$14
  Top 0.203: R1.2 48.26,30.14 48.26,32.68 51.1,35.53 51.1,38.58 52.93,40.41 52.93,41.01 IC5.15
N$15
  Top 0.203: CA0.1 34.24,56.46 37.49,56.46 38.2,55.75 XA.2 38.3,55.65 41.66,52.29 43.38,52.29 IC4.7
N$16
  Top 0.61: TVS1.A 34.9,16.8 34.5,16.4 T1.4 33.2,16.4 32.5,16.4 32.45,16.35 32,16.35 30.45,14.8 30.45,6.3 32.25,4.5 S12.1
N$17
  Top 0.61: 37.35,7.3 35.4,7.3 35,6.9 T2.4 | 37.35,7.3 TVS2.A | 37.35,7.3 S12.2
N$18
  Top 0.61: TVS3.A 47.9,16.8 47.5,16.4 T3.4 46.2,16.4 45.5,16.4 45.45,16.35 44.5,16.35 42.45,14.3 42.45,3.9 S34.1
N$19
  Top 0.203: CA1.1 34.24,50.56 37.9,50.56 38.2,50.87 XA.1 38.41,50.87 38.91,51.38 43.38,51.38 IC4.8
N$20
  Top 0.61: TVS4.A 47.9,7.3 47.5,6.9 T4.4 47.5,6.6 S34.2
N$21
  Top 0.203: T1.3 31.2,23.55 32.8,25.15 43.35,25.15 43.55,24.95 45.65,24.95 48.3,27.6 48.3,27.9 47.6,27.9 47.6,28.4 R1.1
N$22
  Top 0.61: TVS5.A 60.9,16.8 60.5,16.4 T5.4 59.2,16.4 58.5,16.4 58.45,16.35 57.5,16.35 55.95,14.8 55.95,6.6 53.25,3.9 S56.1
N$23
  Top 0.61: TVS6.A 60.9,7.3 60.5,6.9 T6.4 59.2,6.9 58.5,6.9 57.7,6.1 57.7,3.9 S56.2
N$24
  Top 0.61: TVS7.A 74.55,19.95 73.5,18.9 T7.4 72.2,18.9 71.5,18.9 70.4,17.8 70.4,8.55 67.4,5.55 67.3,5.55 65.65,3.9 S78.1
N$25
  Top 0.61: TVS8.A 85.15,9.55 84,8.4 T8.4 82.7,8.4 82,8.4 80.55,6.95 69.95,6.95 67.85,4.85 67.85,3.9 S78.2
N$26  (via drill 0.3)
  Top 0.203: v43.1,24.5 45.8,24.5 49.7,28.4 R2.1 | v31.7,11.4 31.7,13 T2.3
  Bottom 0.203: v43.1,24.5 T2.3 v31.7,11.4
N$27
  Top 0.203: R3.1 52.12,28.31 51.61,28.31 47.35,24.05 45.62,24.05 44.2,22.62 T3.3
N$28  (via drill 0.3)
  Top 0.203: v54.15,23.13 54.15,28.31 R4.1 | v45.31,14.29 44.2,13.18 T4.3
  Bottom 0.203: v45.31,14.29 v54.15,23.13
N$29
  Top 0.203: R5.1 56.29,28.31 56.29,23.44 57.1,22.62 T5.3
N$30
  Top 0.203: IC3.1 8.3,58.1 8.3,57.3 7.2,56.2 X1.2 7.1,56.1 6.9,55.9 6.9,54.6 X0.1
N$31  (via drill 0.3)
  Top 0.203: v58.12,24.15 58.12,28.31 R6.1 | v58.12,14.7 58.12,14.09 57.2,13.18 T6.3
  Bottom 0.203: v58.12,14.7 v58.12,24.15
N$32
  Top 0.203: Q.3 58.93,66.01 58.93,69.46 DF.A 58.93,69.56 57.91,70.58 57.91,72.92 RELAY.9
N$33
  Top 0.203: R7.1 60.25,28.31 60.76,28.31 63.91,25.16 70.1,25.16 T7.3
N$34  (via drill 0.3)
  Top 0.203: v87.99,41.83 94.08,35.73 REA.1 | v80.57,49.24 76.5,49.24 76.3,49.45 74.37,49.45 71.93,51.89 71.93,52.19 IC6.27
  Bottom 0.203: v80.57,49.24 v87.99,41.83
N$35  (via drill 0.3)
  Top 0.203: v66.65,28.31 62.28,28.31 R8.1 | v79.55,15.41 79.96,15.41 80.67,14.7 T8.3
  Bottom 0.203: v79.55,15.41 v66.65,28.31
N$36  (via drill 0.3)
  Top 0.203: v11.89,56.56 10.87,57.58 10.87,58.08 IC3.3
  Bottom 0.203: v11.89,56.56 14.33,56.56 15.44,57.68 BAT.P$2
N$37  (via drill 0.3)
  Top 0.203: v92.96,37.76 94.08,37.76 REB.1 | v81.38,49.35 80.87,49.85 75.18,49.85 73.15,51.89 73.15,52.19 IC6.26
  Bottom 0.203: v81.38,49.35 v92.96,37.76
N$38
  Top 0.406: IC1.6 18.16,39.23 18.1,39.3 15.55,39.3 13.5,37.25 13.5,37.23 DZ.A
  Top 0.61: RSC1.2 RSC.2 14.12,36.88 DZ.A
N$39
  Top 0.203: CV.1 70.51,39.59 70.51,42.64 IC6.1
N$40
  Top 0.203: X.3 14.2,43.2 14.5,43.5 14.5,43.75 14.6,43.85 IC0.8
N$41
  Top 0.203: CE0.1 72.54,60.93 72.54,57.88 73.56,56.86 XE.2 73.66,56.76 75.59,54.83 75.59,52.29 IC6.24
N$42
  Top 0.203: CE1.1 78.44,60.93 78.44,56.86 XE.1 78.33,56.76 77.01,55.44 77.01,52.29 IC6.23
N$43
  Top 0.61: D2.A 10.6,10.95 RZ.2
N$45
  Top 0.61: IC1.8 IC1.7 | IC1.8 IC1.1 | RSC1.1 RSC.1 18.65,35.72 IC1.8
N$46
  Top 0.61: IC1.2 27.46,37.97 D1.C 32.33,36.62 L1.1 37,37.65 42.5,32.15 42.5,29.04 L1'.1
N$49
  Top 0.61: IC1.3 28.36,39.23 CT.1
N$54
  Top 0.203: C6.2 78.03,37.56 80.47,37.56 RR-.1 80.57,37.46 82.5,37.46 RR+.2
N$55
  Top 0.61: RB.1 16.8,40.5 RT.2 19.42,40.3 IC1.5
N$59
  Top 0.203: RBS.2 89.92,42.54 87.27,42.54 87.17,42.64 IC6.14
NC
  Bottom 0.813: RELAY.1 85.38,80.62 JC.1
NO
  Bottom 0.813: RELAY.10 85,73 JO.1
QH*
  Top 0.203: IC5.9 60.66,41.01 64.82,41.01 83.41,22.42 83.41,21.81 89.71,15.51 90.32,15.51 92.15,13.68 92.15,8.3 93.17,7.28 EXTOUT.2
RD+
  Top 0.203: RR+.1 82.5,39.59 82.09,39.59 81.28,40.41 77.52,40.41 77.11,40 77.11,33.8 84.94,25.98 85.55,25.98 87.58,23.95 87.58,23.64 RJ45.RD+ 87.58,24.05 89.92,24.05 96.22,30.35 96.22,32.07 93.27,35.02 93.27,35.12 89.31,39.08 89.1,39.08 85.85,42.34 85.85,42.64 IC6.13
RD-
  Top 0.203: 83.46,38.73 84.53,39.8 84.53,42.64 IC6.12 | 83.46,38.73 83.31,38.58 81.69,38.58 80.77,39.49 80.57,39.49 RR-.2 | RJ45.RD- 85.04,27.5 85.04,28.42 83.52,29.94 83.52,38.68 83.46,38.73
RECAC
  Top 0.61: D0.C 7.38,19.38 CH.1 8.3,19.6 8.35,19.65 8.35,26.88 | C0.+ 8.35,26.88 | 8.35,26.88 9.1,26.88 DZ.C
RESET  (via drill 0.3)
  Top 0.203: ISP.5 66.04,57.17 66.34,56.86 66.34,54.53 RR.1 66.34,54.43 66.34,54.02 v57.51,45.18 | v71.22,50.97 73.15,49.04 76.1,49.04 81.99,43.15 81.99,42.74 IC6.10 | v28.65,50.06 25.09,50.06 C11.2 | v44.81,51.68 44.81,53.92 44.2,54.53 43.48,54.53 IC4.4
  Bottom 0.203: v71.22,50.97 71.22,51.99 66.04,57.17 ISP.5 | v28.65,50.06 37.69,50.06 37.9,49.85 44.6,49.85 45.26,50.51 | 45.26,50.51 45.31,50.56 45.31,51.17 v44.81,51.68 | 45.26,50.51 49.58,46.2 49.68,46.2 53.34,42.54 54.86,42.54 v57.51,45.18
RTS
  Top 0.203: C11.1 23.27,50.16 21.13,50.16 IC0.14
RXD
  Top 0.203: IC0.2 15.54,51.48 16.15,52.09 16.26,52.09 18.59,54.43 18.59,60.42 21.64,63.47 21.64,73.42 22.96,74.75 JP2.10 22.66,74.34 24.18,72.81 24.18,58.69 33.33,49.55 38.41,49.55 39.42,50.56 43.38,50.56 IC4.9
SCK  (via drill 0.3)
  Top 0.203: 44.15,55.49 44.5,55.85 44.5,57.37 v43.99,57.88 | 44.15,55.49 44.09,55.44 43.48,55.44 IC4.3 | v36.68,63.57 32.41,63.57 29.16,66.82 29.16,68.65 25.6,72.21 JP2.11 | v76.1,64.18 76.1,65.5 MICROSD.5 | v73.97,48.43 76.1,48.43 79.45,45.08 79.45,42.74 IC6.8 | v44.7,50.87 44.91,50.87 45.41,51.38 45.41,54.02 44.2,55.24 44.2,55.44 44.15,55.49 | v61.77,51.78 63.5,53.51 ISP.3
  Bottom 0.203: v43.99,57.88 42.37,57.88 v36.68,63.57 | v76.1,64.18 76.1,63.87 71.83,59.61 71.83,50.67 71.78,50.62 | 71.78,50.62 71.53,50.36 70.81,50.36 67.56,53.61 60.96,53.61 60.76,53.41 60.15,53.41 59.84,53.71 59.84,54.32 62.69,57.17 63.5,57.17 ISP.3 | 71.78,50.62 v73.97,48.43 | v44.7,50.87 44.2,51.38 44.2,51.99 44.5,52.29 45.11,52.29 49.28,48.13 49.28,47.21 53.54,42.95 54.15,42.95 57.51,46.3 57.51,49.95 59.33,51.78 v61.77,51.78
SCL  (via drill 0.3)
  Top 0.203: RCL.1 10.77,66.82 10.77,64.28 IC3.6 10.87,64.18 10.87,63.67 12.29,62.25 13.72,62.25 | 13.72,62.25 14.53,62.25 IC7.1 | IC4.19 50.8,48.43 v50.7,48.53 | v20.73,58.9 v20.73,57.07 | 13.72,62.25 v13.72,62.66 | v14.33,69.67 15.34,70.68 15.34,72.21 JP2.3
  Bottom 0.203: v50.7,48.53 45.62,53.61 24.18,53.61 v20.73,57.07 | v20.73,58.9 20.42,58.9 16.66,62.66 14.33,62.66 | v13.72,62.66 14.33,62.66 | 14.33,62.66 v14.33,69.67
SDA  (via drill 0.3)
  Top 0.203: 12.19,65.6 12.19,64.28 IC3.5 | 12.19,65.6 12.19,66.82 RDA.1 | v15.65,61.03 16.36,61.74 16.36,62.15 IC7.3 | v51.51,48.63 51.51,47.21 IC4.20 | v12.9,65.6 12.19,65.6
  Bottom 0.203: JP2.1 12.9,72.21 v12.9,65.6 12.9,62.55 14.43,61.03 v15.65,61.03 17.68,61.03 24.69,54.02 46.13,54.02 v51.51,48.63
TCT  (via drill 0.3)
  Top 0.203: L2.1 91.03,59.91 91.03,57.88 C7.2 90.93,57.88 87.48,57.88 RT-.1 87.48,57.98 85.34,57.98 RT+.2 85.24,57.98 84.63,57.37 v84.02,57.37
  Bottom 0.203: v84.02,57.37 84.02,56.46 79.25,51.68 79.25,49.65 80.67,48.23 80.67,36.65 86.26,31.06 86.26,26.99 85.14,25.88 85.14,24.96 RJ45.P4
TD+  (via drill 0.3)
  Top 0.203: RT+.1 85.24,55.95 85.24,53.31 84.63,52.7 84.63,52.29 IC6.17 84.53,52.19 v84.53,44.16 | v89.41,22.02 88.59,22.02 87.68,21.1 RJ45.TD+
  Bottom 0.203: v84.53,44.16 84.53,37.66 84.23,37.36 84.23,33.7 89.41,28.52 v89.41,22.02
TD-
  Top 0.203: RT-.2 87.48,55.95 87.48,54.32 85.85,52.7 85.85,52.29 IC6.16 85.85,52.19 85.85,46.91 89.2,43.55 90.63,43.55 95,39.19 95,34.51 96.62,32.89 96.62,30.14 88.9,22.42 85.14,22.42 RJ45.TD-
TXD
  Top 0.203: 17.83,51.12 22.25,55.54 22.25,66.11 22.05,66.31 22.05,71.29 22.96,72.21 JP2.9 | 17.83,51.12 16.97,50.26 15.54,50.26 IC0.3 | 17.83,51.12 19.41,49.55 21.84,49.55 26.21,45.18 39.83,45.18 40.03,45.38 40.03,47.11 42.67,49.75 43.38,49.75 IC4.10
VCC  (via drill 0.3)
  Top 0.203: MICROSD.4 74.98,65.5 74.88,65.4 74.88,63.57 RSD.2 74.98,63.57 89.41,63.57 90.93,62.05 L2.2 91.03,61.94 91.03,61.74 92.05,60.73 92.05,57.37 91.64,56.97 90.32,56.97 89.36,56 | 89.36,56 87.88,54.53 87.88,53 87.17,52.29 IC6.15 | 59.28,42.39 59.33,42.34 59.33,41.12 IC5.10 | 59.28,42.39 56.39,45.28 55.98,45.28 ROE.2 55.88,45.38 53.85,47.41 53.85,50.06 52.38,51.53 | 64.06,42.39 64.01,42.44 59.33,42.44 59.28,42.39 | 64.06,42.39 83.82,22.62 83.82,22.02 89.92,15.92 90.53,15.92 92.76,13.68 93.37,13.68 94.39,12.67 94.39,9.52 95.71,8.2 95.71,7.28 EXTOUT.1 | 64.06,42.39 64.11,42.44 64.11,48.94 66.95,51.78 C13.1 67.06,51.89 68.48,51.89 C12.1 68.58,51.89 70.21,51.89 70.51,52.19 IC6.28 70.61,52.29 70.61,52.7 71.42,53.51 73.56,53.51 74.37,52.7 74.37,52.29 IC6.25 74.47,52.19 74.47,51.89 76.1,50.26 80.16,50.26 80.67,50.77 80.67,52.19 IC6.20 80.77,52.29 81.99,52.29 IC6.19 81.99,52.39 81.99,52.6 83.82,54.43 83.82,56.25 84.43,56.86 88.49,56.86 89.36,56 | 14.28,50.01 15.44,48.84 IC0.4 | 14.28,50.01 14.22,50.06 13.11,50.06 C10.2 | 14.28,50.01 14.33,50.06 v14.33,52.29 14.33,57.37 17.07,60.12 17.07,62.96 16.46,63.57 IC7.4 16.56,64.79 17.58,64.79 18.59,65.81 v19,65.81 | C2.+ 30.99,27.09 30.99,24.66 28.04,21.71 28.04,19.48 IC2.4 | IC5.16 51.71,41.12 49.48,41.12 C9.1 49.38,41.22 v49.38,43.55 | RR.2 64.62,54.43 64.62,53.51 61.37,50.26 59.13,50.26 57.4,51.99 C3.1 57.3,52.09 56.69,52.09 56.59,52.19 55.07,52.19 IC4.27 54.97,52.29 54.25,52.29 53.7,52.85 | v19.91,52.29 20.32,52.7 21.03,52.7 IC0.16 21.13,52.8 22.96,54.63 v24.99,54.63 v33.83,45.79 | v41.45,54.63 42.27,53.82 43.38,53.82 IC4.5
  Top 0.203: v49.38,45.59 49.38,47.21 IC4.17 49.38,47.31 49.38,48.53 52.38,51.53 | IC4.38 49.99,58.9 49.89,59 49.89,60.93 C5.1 49.99,60.93 50.7,61.64 v51.41,61.64 | v52.73,62.96 54.66,62.96 RPR.2 | v53.65,54.02 53.65,52.9 53.7,52.85 | 52.38,51.53 53.7,52.85
  Bottom 0.203: 21.64,73.42 29.46,73.42 30.58,72.31 JP2.15 | 21.64,73.42 20.12,73.42 18.8,74.75 17.98,74.75 JP2.6 | 21.64,73.42 21.64,70.48 19,67.84 v19,65.81 | v14.33,52.29 v19.91,52.29 | v24.99,54.63 v41.45,54.63 | v49.38,45.59 49.38,45.28 | 49.38,45.28 v49.38,43.55 49.38,38.88 36.58,26.08 32.11,26.08 C2.+ | v33.83,45.79 41.25,45.79 41.76,45.28 49.38,45.28 | v52.73,62.96 v51.41,61.64 51.41,58.79 50.39,57.78 50.39,57.17 50.7,56.86 50.8,56.86 v53.65,54.02
VIN  (via drill 0.3)
  Top 0.305: LCD.15 53.65,67.23 54.05,67.23 56.08,65.19 57.51,65.19 58.62,64.08 59.74,64.08 60.05,63.77 60.05,60.73 60.96,59.81 ISP.2 | RELAY.2 57.91,80.54 62.99,75.46 62.99,69.56 DF.C 62.89,69.46 v61.57,68.14 | 16.66,69.06 14.73,69.06 14.33,68.65 12.29,68.65 RDA.2 10.77,68.55 RCL.2 10.67,68.45 8.13,65.91 8.13,64.59 IC3.8 8.23,64.28 8.03,64.48 6.3,64.48 C8.1 6.1,64.48 5.28,63.67 5.28,48.43 6.81,46.91 6.81,42.03 6.3,41.52 6.3,37.66 7,36.95 7.01,36.95 7.92,36.95 9.14,35.73 9.45,35.73 USB.VBUS | 16.66,69.06 18.39,69.06 20.12,67.33 20.52,67.33 LCD.2 | 16.66,69.06 16.66,72.71 15.44,73.93 15.44,74.75 JP2.4
  Top 0.406: F1.2 14.15,17.05 15.2,16 19.85,16 20.95,17.1 IC2.3 | v6.5,24.65 5.1,26.05 5.1,26.8 6.95,28.65 6.95,33.55 6.15,34.35 6.15,36.1 7,36.95 | v9.2,24.65 9.1,24.55 9.1,20.45 10.55,19 D2.C
  Top 0.61: F1.2 14.15,18.15 14.15,18.85 13.1,19.9 11.5,19.9 D2.C
  Bottom 0.305: v61.57,68.14 56.79,63.37 55.58,63.37 53.65,65.3 53.65,67.23 LCD.15 | LCD.2 20.62,67.33 22.35,69.06 38,69.06 39.93,70.99 RF.2 40.13,71.09 40.13,74.85 47.14,81.86 48.26,81.86 49.48,80.64 57.81,80.64 RELAY.2
  Bottom 0.406: v9.2,24.65 v6.5,24.65
VIN1
  Top 0.406: RT.1 17,36.25 17.65,35.6 17.65,31.4 19.3,29.75 21.27,29.75 C1.+
  Top 0.61: L1.2 37,29.46 L1'.2 | CL.1 24.15,29.53 C1.+ 22.7,27.9 22.7,25.55 18.3,21.15 18.3,19 18.25,18.95 F1.1
  Bottom 0.61: L1'.2 33.85,28.7 32.85,29.7 24.32,29.7 C1.+

## Text on the board
tNames: OpenSprinkler v2.2 | NC | www.opensprinkler.com | GND VIN VCC A06 RXD INT0 SI INT2 D15 | CO | A3 VIN GND | NO | SDA SCL A05 A07 TXD SCK SO VCC GND | PWR | EXTOUT | S1-8 | RAIN
BoxDim: Serpac WM-032C Enclosure | All units are in inch | Left | Right | Front | Bottom